# Altium schematic sheet DX-NR02_SCH_Part_AD.SchDoc
size A4
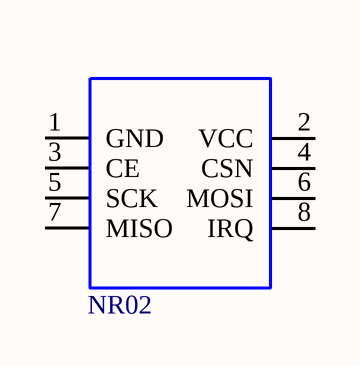
[diagram p0: DX-NR02_SCH_Part_AD.SchDoc]

## Parts
?  NR02

## Nets

Not connected (* = marked no-connect by the designer): ? 1(GND) 2(VCC) 3(CE) 4(CSN) 5(SCK) 6(MOSI) 7(MISO) 8(IRQ)